# Altium schematic sheet obc-v2_MCU-PinOut.SchDoc
size 420 x 297 mm; SheetNumber: 23; SheetTotal: 23
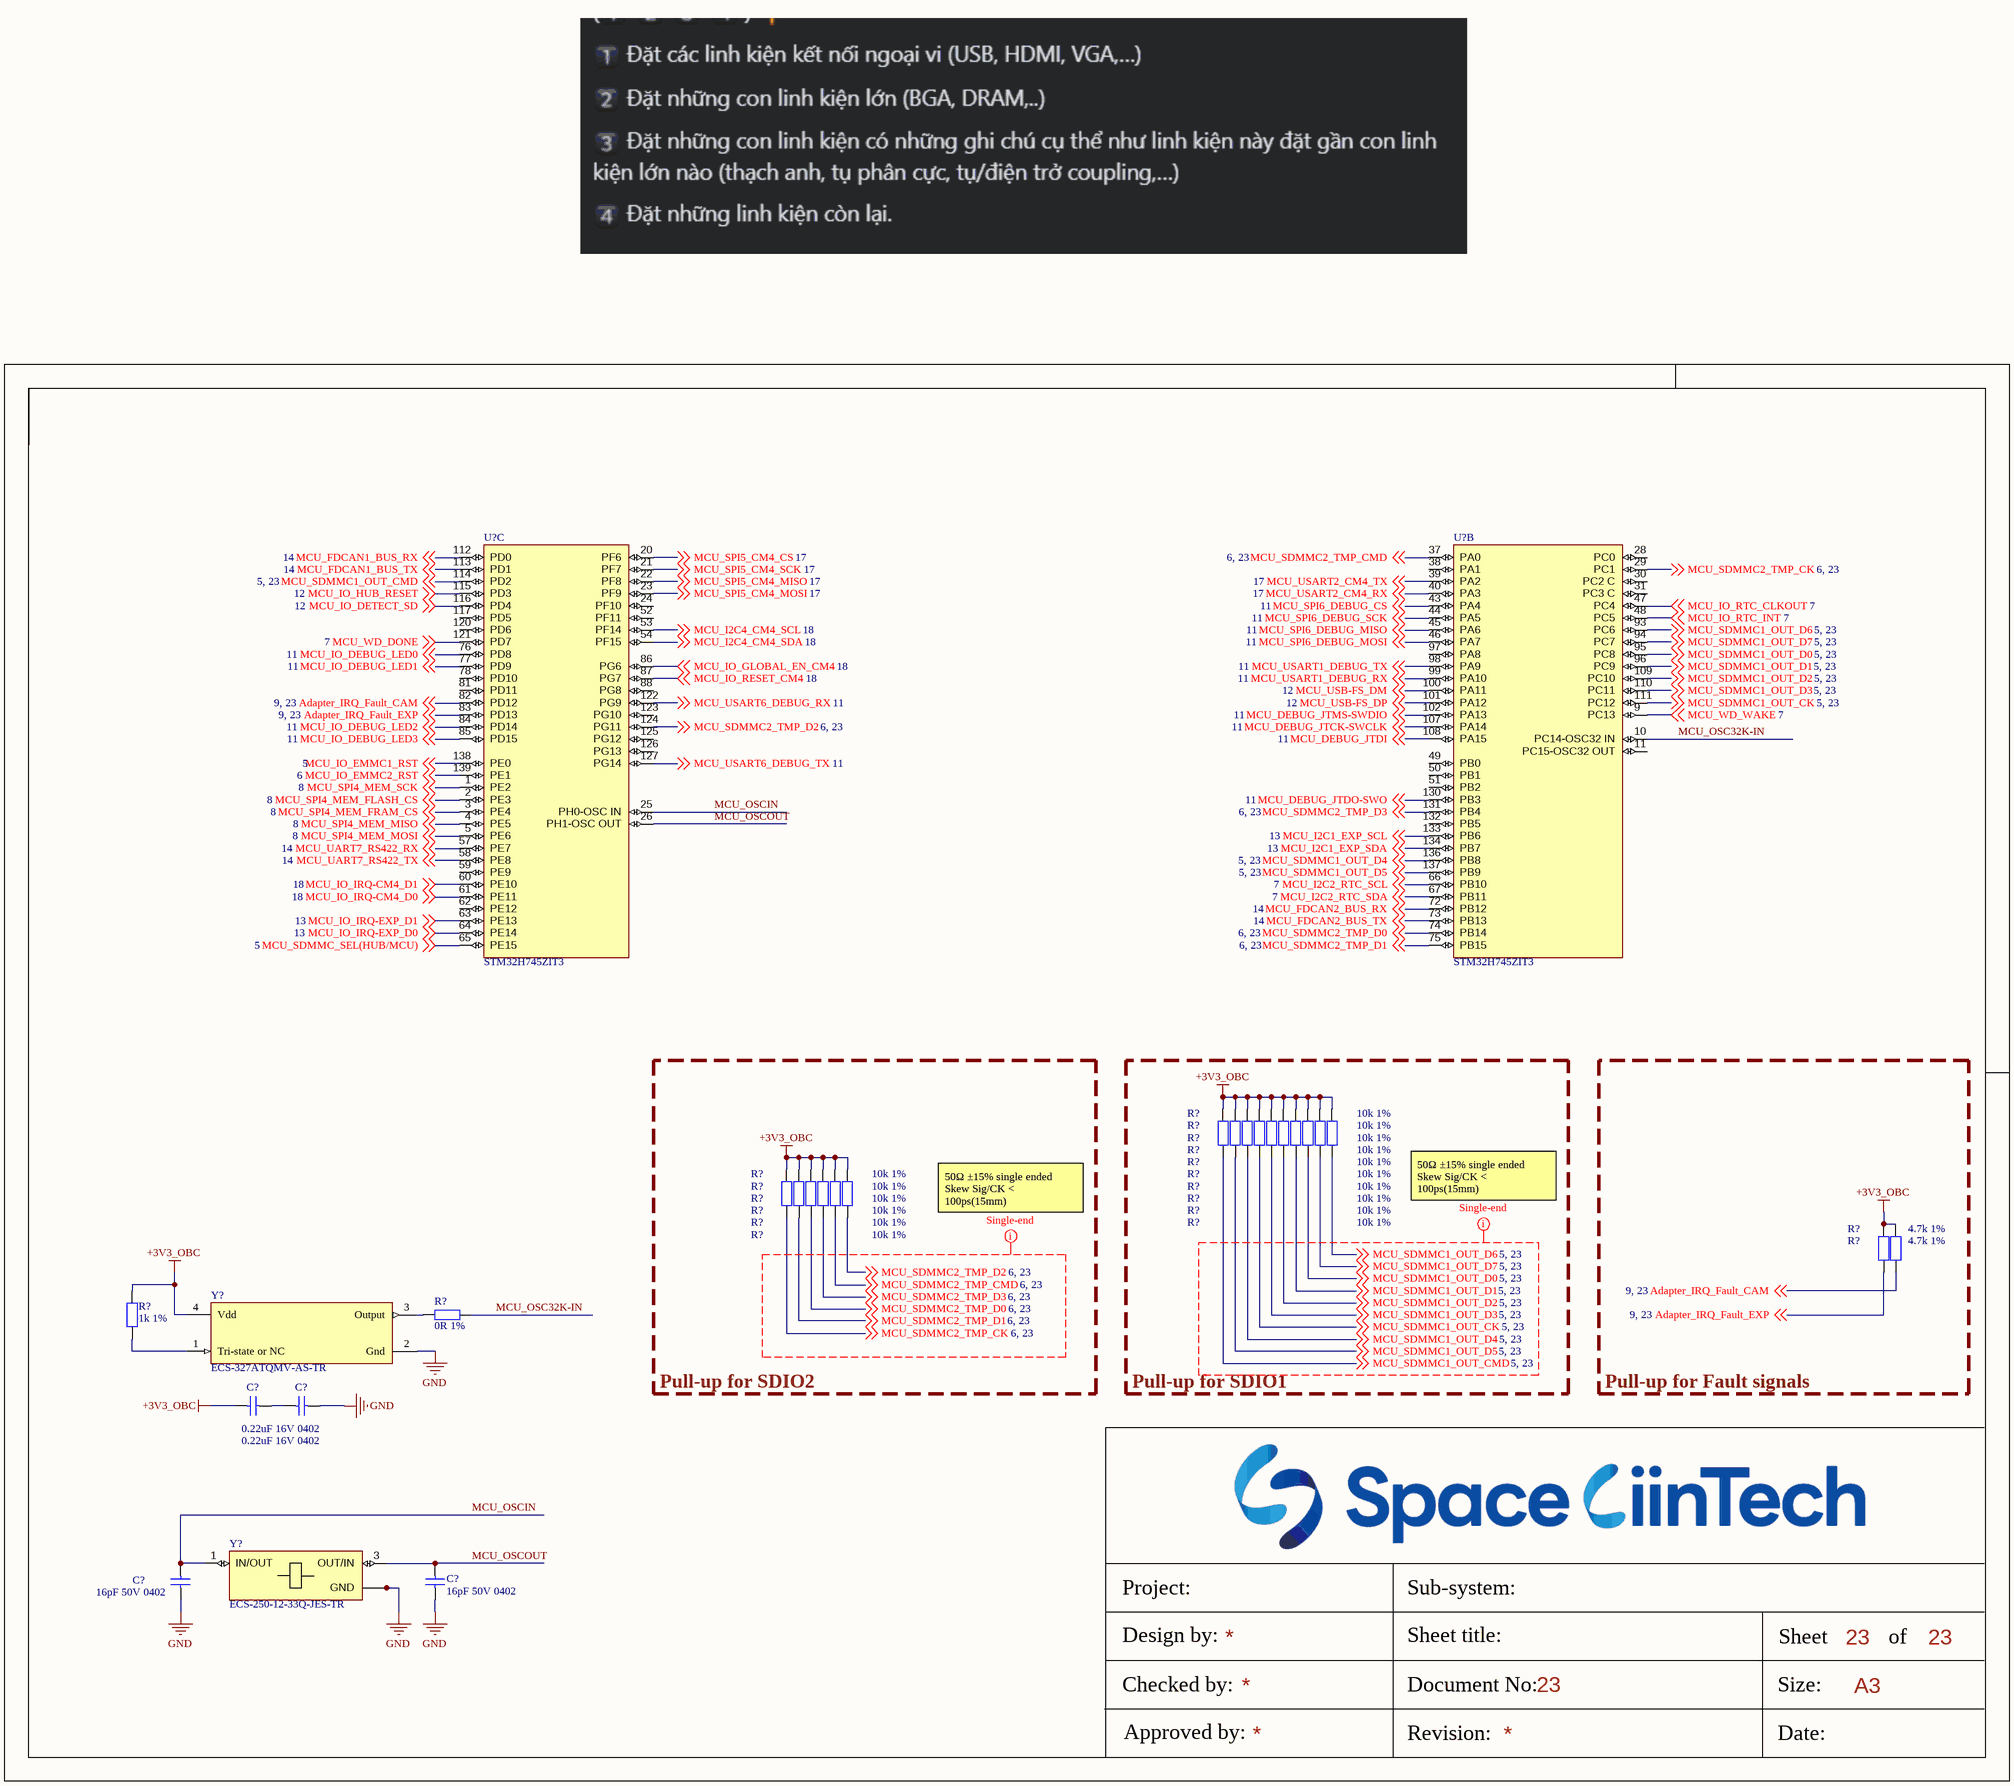
[diagram p0: obc-v2_MCU-PinOut.SchDoc]

## Parts
(Parts that share a designator on the sheet are numbered #1, #2 ... from top to bottom, then left to right.)
C?#1  0.22uF 16V 0402  [tu 0402]
C?#2  0.22uF 16V 0402  [tu 0402]
C?#3  16pF 50V 0402  [tu 0402]
C?#4  16pF 50V 0402  [tu 0402]
R?#1  10k 1%  [tro smd 0603]
R?#2  10k 1%  [tro smd 0603]
R?#3  10k 1%  [tro smd 0603]
R?#4  10k 1%  [tro smd 0603]
R?#5  10k 1%  [tro smd 0603]
R?#6  10k 1%  [tro smd 0603]
R?#7  10k 1%  [tro smd 0603]
R?#8  10k 1%  [tro smd 0603]
R?#9  10k 1%  [tro smd 0603]
R?#10  10k 1%  [tro smd 0603]
R?#11  10k 1%  [tro smd 0603]
R?#12  10k 1%  [tro smd 0603]
R?#13  10k 1%  [tro smd 0603]
R?#14  10k 1%  [tro smd 0603]
R?#15  10k 1%  [tro smd 0603]
R?#16  10k 1%  [tro smd 0603]
R?#17  4.7k 1%  [tro smd 0603]
R?#18  4.7k 1%  [tro smd 0603]
R?#19  1k 1%  [tro smd 0603]
R?#20  0R 1%  [tro smd 0603]
U?#1  STM32H745ZIT3  [FP-LQFP144-1A-MFG]  (part C of 3)
U?#2  STM32H745ZIT3  [FP-LQFP144-1A-MFG]  (part B of 3)
Y?#1  ECS-327ATQMV-AS-TR  [FP-327ATQMV-MFG]
Y?#2  ECS-250-12-33Q-JES-TR  [XTAL_ECS-250-12-33Q-JES-TR]

## Blocks framed on the sheet
Pull-up for SDIO2: R?#11-R?#16
Pull-up for SDIO1: R?#1-R?#10
Pull-up for Fault signals: R?#17 R?#18

## Nets
+3V3_OBC: C?#1.1 R?#1.2 R?#2.2 R?#3.2 R?#4.2 R?#5.2 R?#6.2 R?#7.2 R?#8.2 R?#9.2 R?#10.2 R?#11.2 R?#12.2 R?#13.2 R?#14.2 R?#15.2 R?#16.2 R?#17.2 R?#18.2 R?#19.1 Y?#1.4(Vdd)
GND: C?#2.2 C?#3.1 C?#4.1 Y?#1.2(Gnd) Y?#2.2(GND) Y?#2.4(GND)
Adapter_IRQ_Fault_CAM: R?#18.1 U?#1.82(PD12) ; off-sheet Adapter_IRQ_Fault_CAM
Adapter_IRQ_Fault_EXP: R?#17.1 U?#1.83(PD13) ; off-sheet Adapter_IRQ_Fault_EXP
MCU_DEBUG_JTCK-SWCLK: U?#2.107(PA14) ; off-sheet MCU_DEBUG_JTCK-SWCLK
MCU_DEBUG_JTDI: U?#2.108(PA15) ; off-sheet MCU_DEBUG_JTDI
MCU_DEBUG_JTDO-SWO: U?#2.130(PB3) ; off-sheet MCU_DEBUG_JTDO-SWO
MCU_DEBUG_JTMS-SWDIO: U?#2.102(PA13) ; off-sheet MCU_DEBUG_JTMS-SWDIO
MCU_FDCAN1_BUS_RX: U?#1.112(PD0) ; off-sheet MCU_FDCAN1_BUS_RX
MCU_FDCAN1_BUS_TX: U?#1.113(PD1) ; off-sheet MCU_FDCAN1_BUS_TX
MCU_FDCAN2_BUS_RX: U?#2.72(PB12) ; off-sheet MCU_FDCAN2_BUS_RX
MCU_FDCAN2_BUS_TX: U?#2.73(PB13) ; off-sheet MCU_FDCAN2_BUS_TX
MCU_I2C1_EXP_SCL: U?#2.133(PB6) ; off-sheet MCU_I2C1_EXP_SCL
MCU_I2C1_EXP_SDA: U?#2.134(PB7) ; off-sheet MCU_I2C1_EXP_SDA
MCU_I2C2_RTC_SCL: U?#2.66(PB10) ; off-sheet MCU_I2C2_RTC_SCL
MCU_I2C2_RTC_SDA: U?#2.67(PB11) ; off-sheet MCU_I2C2_RTC_SDA
MCU_I2C4_CM4_SCL: U?#1.53(PF14) ; off-sheet MCU_I2C4_CM4_SCL
MCU_I2C4_CM4_SDA: U?#1.54(PF15) ; off-sheet MCU_I2C4_CM4_SDA
MCU_IO_DEBUG_LED0: U?#1.76(PD8) ; off-sheet MCU_IO_DEBUG_LED0
MCU_IO_DEBUG_LED1: U?#1.77(PD9) ; off-sheet MCU_IO_DEBUG_LED1
MCU_IO_DEBUG_LED2: U?#1.84(PD14) ; off-sheet MCU_IO_DEBUG_LED2
MCU_IO_DEBUG_LED3: U?#1.85(PD15) ; off-sheet MCU_IO_DEBUG_LED3
MCU_IO_DETECT_SD: U?#1.116(PD4) ; off-sheet MCU_IO_DETECT_SD
MCU_IO_EMMC1_RST: U?#1.138(PE0) ; off-sheet MCU_IO_EMMC1_RST
MCU_IO_EMMC2_RST: U?#1.139(PE1) ; off-sheet MCU_IO_EMMC2_RST
MCU_IO_GLOBAL_EN_CM4: U?#1.86(PG6) ; off-sheet MCU_IO_GLOBAL_EN_CM4
MCU_IO_HUB_RESET: U?#1.115(PD3) ; off-sheet MCU_IO_HUB_RESET
MCU_IO_IRQ-CM4_D0: U?#1.61(PE11) ; off-sheet MCU_IO_IRQ-CM4_D0
MCU_IO_IRQ-CM4_D1: U?#1.60(PE10) ; off-sheet MCU_IO_IRQ-CM4_D1
MCU_IO_IRQ-EXP_D0: U?#1.64(PE14) ; off-sheet MCU_IO_IRQ-EXP_D0
MCU_IO_IRQ-EXP_D1: U?#1.63(PE13) ; off-sheet MCU_IO_IRQ-EXP_D1
MCU_IO_RESET_CM4: U?#1.87(PG7) ; off-sheet MCU_IO_RESET_CM4
MCU_IO_RTC_CLKOUT: U?#2.47(PC4) ; off-sheet MCU_IO_RTC_CLKOUT
MCU_IO_RTC_INT: U?#2.48(PC5) ; off-sheet MCU_IO_RTC_INT
MCU_OSC32K-IN: R?#20.1 U?#2.10(PC14-OSC32_IN)
MCU_OSCIN: C?#3.2 U?#1.25(PH0-OSC_IN) Y?#2.1(IN/OUT)
MCU_OSCOUT: C?#4.2 U?#1.26(PH1-OSC_OUT) Y?#2.3(OUT/IN)
MCU_SDMMC1_OUT_CK: R?#4.1 U?#2.111(PC12) ; off-sheet MCU_SDMMC1_OUT_CK
MCU_SDMMC1_OUT_CMD: R?#1.1 U?#1.114(PD2) ; off-sheet MCU_SDMMC1_OUT_CMD
MCU_SDMMC1_OUT_D0: R?#8.1 U?#2.95(PC8) ; off-sheet MCU_SDMMC1_OUT_D0
MCU_SDMMC1_OUT_D1: R?#7.1 U?#2.96(PC9) ; off-sheet MCU_SDMMC1_OUT_D1
MCU_SDMMC1_OUT_D2: R?#6.1 U?#2.109(PC10) ; off-sheet MCU_SDMMC1_OUT_D2
MCU_SDMMC1_OUT_D3: R?#5.1 U?#2.110(PC11) ; off-sheet MCU_SDMMC1_OUT_D3
MCU_SDMMC1_OUT_D4: R?#3.1 U?#2.136(PB8) ; off-sheet MCU_SDMMC1_OUT_D4
MCU_SDMMC1_OUT_D5: R?#2.1 U?#2.137(PB9) ; off-sheet MCU_SDMMC1_OUT_D5
MCU_SDMMC1_OUT_D6: R?#10.1 U?#2.93(PC6) ; off-sheet MCU_SDMMC1_OUT_D6
MCU_SDMMC1_OUT_D7: R?#9.1 U?#2.94(PC7) ; off-sheet MCU_SDMMC1_OUT_D7
MCU_SDMMC2_TMP_CK: R?#11.1 U?#2.29(PC1) ; off-sheet MCU_SDMMC2_TMP_CK
MCU_SDMMC2_TMP_CMD: R?#15.1 U?#2.37(PA0) ; off-sheet MCU_SDMMC2_TMP_CMD
MCU_SDMMC2_TMP_D0: R?#13.1 U?#2.74(PB14) ; off-sheet MCU_SDMMC2_TMP_D0
MCU_SDMMC2_TMP_D1: R?#12.1 U?#2.75(PB15) ; off-sheet MCU_SDMMC2_TMP_D1
MCU_SDMMC2_TMP_D2: R?#16.1 U?#1.124(PG11) ; off-sheet MCU_SDMMC2_TMP_D2
MCU_SDMMC2_TMP_D3: R?#14.1 U?#2.131(PB4) ; off-sheet MCU_SDMMC2_TMP_D3
MCU_SDMMC_SEL(HUB/MCU): U?#1.65(PE15) ; off-sheet MCU_SDMMC_SEL(HUB/MCU)
MCU_SPI4_MEM_FLASH_CS: U?#1.2(PE3) ; off-sheet MCU_SPI4_MEM_FLASH_CS
MCU_SPI4_MEM_FRAM_CS: U?#1.3(PE4) ; off-sheet MCU_SPI4_MEM_FRAM_CS
MCU_SPI4_MEM_MISO: U?#1.4(PE5) ; off-sheet MCU_SPI4_MEM_MISO
MCU_SPI4_MEM_MOSI: U?#1.5(PE6) ; off-sheet MCU_SPI4_MEM_MOSI
MCU_SPI4_MEM_SCK: U?#1.1(PE2) ; off-sheet MCU_SPI4_MEM_SCK
MCU_SPI5_CM4_CS: U?#1.20(PF6) ; off-sheet MCU_SPI5_CM4_CS
MCU_SPI5_CM4_MISO: U?#1.22(PF8) ; off-sheet MCU_SPI5_CM4_MISO
MCU_SPI5_CM4_MOSI: U?#1.23(PF9) ; off-sheet MCU_SPI5_CM4_MOSI
MCU_SPI5_CM4_SCK: U?#1.21(PF7) ; off-sheet MCU_SPI5_CM4_SCK
MCU_SPI6_DEBUG_CS: U?#2.43(PA4) ; off-sheet MCU_SPI6_DEBUG_CS
MCU_SPI6_DEBUG_MISO: U?#2.45(PA6) ; off-sheet MCU_SPI6_DEBUG_MISO
MCU_SPI6_DEBUG_MOSI: U?#2.46(PA7) ; off-sheet MCU_SPI6_DEBUG_MOSI
MCU_SPI6_DEBUG_SCK: U?#2.44(PA5) ; off-sheet MCU_SPI6_DEBUG_SCK
MCU_UART7_RS422_RX: U?#1.57(PE7) ; off-sheet MCU_UART7_RS422_RX
MCU_UART7_RS422_TX: U?#1.58(PE8) ; off-sheet MCU_UART7_RS422_TX
MCU_USART1_DEBUG_RX: U?#2.99(PA10) ; off-sheet MCU_USART1_DEBUG_RX
MCU_USART1_DEBUG_TX: U?#2.98(PA9) ; off-sheet MCU_USART1_DEBUG_TX
MCU_USART2_CM4_RX: U?#2.40(PA3) ; off-sheet MCU_USART2_CM4_RX
MCU_USART2_CM4_TX: U?#2.39(PA2) ; off-sheet MCU_USART2_CM4_TX
MCU_USART6_DEBUG_RX: U?#1.122(PG9) ; off-sheet MCU_USART6_DEBUG_RX
MCU_USART6_DEBUG_TX: U?#1.127(PG14) ; off-sheet MCU_USART6_DEBUG_TX
MCU_USB-FS_DM: U?#2.100(PA11) ; off-sheet MCU_USB-FS_DM
MCU_USB-FS_DP: U?#2.101(PA12) ; off-sheet MCU_USB-FS_DP
MCU_WD_DONE: U?#1.121(PD7) ; off-sheet MCU_WD_DONE
MCU_WD_WAKE: U?#2.9(PC13) ; off-sheet MCU_WD_WAKE
NetC?#1_2: C?#1.2 C?#2.1
NetR?#19_2: R?#19.2 Y?#1.1(Tri-state_or_NC)
NetR?#20_2: R?#20.2 Y?#1.3(Output)

Not connected (* = marked no-connect by the designer): U?#1 24(PF10) 52(PF11) 59(PE9) 62(PE12) 78(PD10) 81(PD11) 88(PG8) 117(PD5) 120(PD6) 123(PG10) 125(PG12) 126(PG13); U?#2 11(PC15-OSC32_OUT) 28(PC0) 30(PC2_C) 31(PC3_C) 38(PA1) 49(PB0) 50(PB1) 51(PB2) 97(PA8) 132(PB5)

## Layout directives
mark named Single-end: MCU_SDMMC1_OUT_CK, MCU_SDMMC1_OUT_CMD, MCU_SDMMC1_OUT_D0, MCU_SDMMC1_OUT_D1, MCU_SDMMC1_OUT_D2, MCU_SDMMC1_OUT_D3, MCU_SDMMC1_OUT_D4, MCU_SDMMC1_OUT_D5, MCU_SDMMC1_OUT_D6, MCU_SDMMC1_OUT_D7, MCU_SDMMC2_TMP_CK, MCU_SDMMC2_TMP_CMD, MCU_SDMMC2_TMP_D0, MCU_SDMMC2_TMP_D1, MCU_SDMMC2_TMP_D2, MCU_SDMMC2_TMP_D3

## Notes on the sheet
- 50Ω ±15% single ended
  Skew Sig/CK < 100ps(15mm)
  Max Length 100mm
- Project:
- Sub-system:
- Design by:
- Sheet title:
- Sheet
- A3
- of
- Checked by:
- Approved by:
- Revision:
- Document No:
- Size:
- Date:

## Library data of the parts
C?#1 C?#2 = Tu 0402 33nF 10V: 0.22 µF ±10% 16V Ceramic Capacitor X7R 0402 (1005 Metric): GCM155R71C224KE02D; Chung_Loai: Dán; Don_Vi: Con; So_Chan: 2; Ten_Linh_Kien: Tụ 0402 33nF X7R 10V GRM155R71A333KA01D; Ma_Hang: MH007853; Kieu_Chan: *
C?#3 C?#4 = Tu 0402 33nF 10V: 16 pF ±1% 50V Ceramic Capacitor C0G, NP0 0402 (1005 Metric): GJM1555C1H160FB01J; Chung_Loai: Dán; Don_Vi: Con; So_Chan: 2; Ten_Linh_Kien: Tụ 0402 33nF X7R 10V GRM155R71A333KA01D; Ma_Hang: MH007853; Kieu_Chan: *
R?#1-R?#20 = Tro 0603 1% 10k: RES 4.7K OHM 1% 1/10W 0603, P/N: ERJ-U03F4701V; Chung_Loai: Dán; Don_Vi: Con; So_Chan: 2; Ten_Linh_Kien: Trở 0603 1% 10k; Ma_Hang: MH006333; Kieu_Chan: *
U?#1 U?#2 = CMP-12105-000054-1: HIGH-PERFORMANCE AND DSP WITH DP; Manufacturer Part Number: STM32H745ZIT6; Manufacturer: STMicroelectronics; Number Of Timers/Counters: 20; Min Supply Voltage: 1.62V; Frequency: 480MHz; Number Of I2C Channels: 4; Memory Type: FLASH; Number Of I/Os: 97; Number Of Pwm Channels: 42; Number Of Usb Channels: 2; Ram Size: 1MBytes; Memory Size: 2MBytes; Data Bus Width: 32bits; Number Of Adc Channels: 23; Number Of Ethernet Channels: 1; Number Of Uart Channels: 9; Interface: I2C,SPI,UART,USART,CAN,USB,LIN,IrDA,Ethernet,I2S,Other; Number Of A/D Converters: 3; Max Junction Temp: +125°C; Max Supply Voltage: 3.6V; Core Architecture: ARM Cortex-M4, Cortex-M7; Number Of Spi Channels: 6; Standoff Height: 0.05mm; Ambient Temperature Range Low: -40°C; Lead Free: Yes; Automotive: No; Height: 1.6mm; Device Class L1: Integrated Circuits (ICs); Ambient Temperature Range High: +85°C; RoHS: TRUE; Temperature Range High: +125°C; Temperature: -40°C to +125°C; Category: IC; Device Class L2: Embedded Processors and Controllers; Number Of Cores: 2; Temperature Range Low: -40°C; Octopart: https://octopart.com/stm32h745zit6-stmicroelectronics-100293939; Digikey Description: HIGH-PERFORMANCE AND DSP WITH DP; Package: LQFP144-1A; Device Class L3: Microcontrollers; ComponentLink2URL: https://www.st.com/resource/en/datasheet/stm32h745zi.pdf; ComponentLink2Description: Datasheet
Y?#1 = CMP-40224-000027-1: XTAL OSC XO 32.7680KHZ CMOS SMD; RoHS Compliant: Yes
Y?#2 = ECS-250-12-33Q-JES-TR: 25 MHz Â±20ppm Crystal 12pF 40 Ohms 4-SMD, No Lead; MF: ECS Inc.; Value: *; Purchase-URL: https://pricing.snapeda.com/search/part/ECS-250-12-33Q-JES-TR/?ref=eda; Package: ECS-33B ECS Inc.; Availability: In Stock; SnapEDA_Link: https://www.snapeda.com/parts/ECS-250-12-33Q-JES-TR/ECS+Inc./view-part/?ref=snap; MP: ECS-250-12-33Q-JES-TR; Check_prices: https://www.snapeda.com/parts/ECS-250-12-33Q-JES-TR/ECS+Inc./view-part/?ref=eda; Price: None